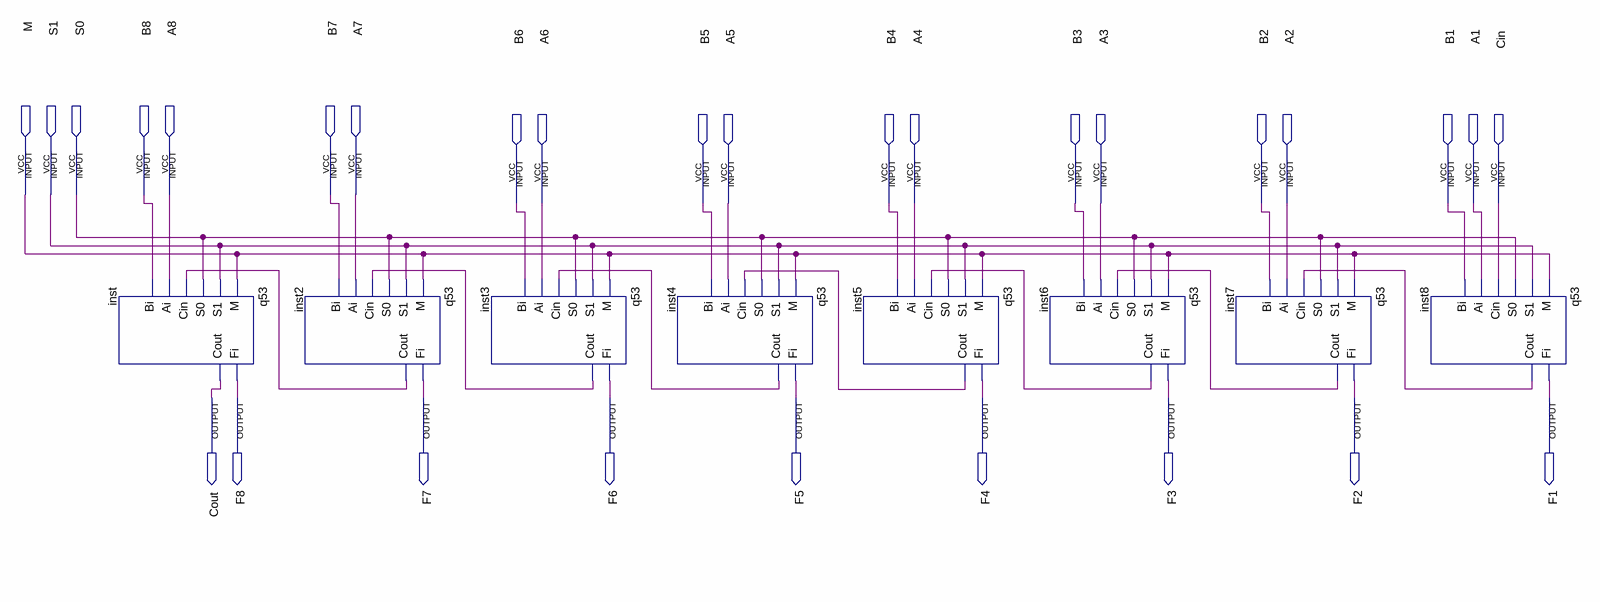
[diagram p0: schematic sheet]
// Quartus schematic q53final.bdf as structural Verilog: 8 symbols, 29 pins
module q53final (
  input  M,
  input  S1,
  input  S0,
  input  B8,
  input  A8,
  input  B7,
  input  A7,
  input  B6,
  input  A6,
  input  B5,
  input  A5,
  input  B4,
  input  A4,
  input  B3,
  input  A3,
  input  B2,
  input  A2,
  input  B1,
  input  A1,
  input  Cin,
  output Cout,
  output F8,
  output F7,
  output F6,
  output F5,
  output F4,
  output F3,
  output F2,
  output F1
);

  wire inst2_cout, inst3_cout, inst4_cout, inst5_cout, inst6_cout, inst7_cout, inst8_cout;

  q53 inst (.M(M), .S1(S1), .S0(S0), .Cin(inst2_cout), .Ai(A8), .Bi(B8), .Fi(F8), .Cout(Cout));
  q53 inst2 (.M(M), .S1(S1), .S0(S0), .Cin(inst3_cout), .Ai(A7), .Bi(B7), .Fi(F7), .Cout(inst2_cout));
  q53 inst3 (.M(M), .S1(S1), .S0(S0), .Cin(inst4_cout), .Ai(A6), .Bi(B6), .Fi(F6), .Cout(inst3_cout));
  q53 inst4 (.M(M), .S1(S1), .S0(S0), .Cin(inst5_cout), .Ai(A5), .Bi(B5), .Fi(F5), .Cout(inst4_cout));
  q53 inst5 (.M(M), .S1(S1), .S0(S0), .Cin(inst6_cout), .Ai(A4), .Bi(B4), .Fi(F4), .Cout(inst5_cout));
  q53 inst6 (.M(M), .S1(S1), .S0(S0), .Cin(inst7_cout), .Ai(A3), .Bi(B3), .Fi(F3), .Cout(inst6_cout));
  q53 inst7 (.M(M), .S1(S1), .S0(S0), .Cin(inst8_cout), .Ai(A2), .Bi(B2), .Fi(F2), .Cout(inst7_cout));
  q53 inst8 (.M(M), .S1(S1), .S0(S0), .Cin(Cin), .Ai(A1), .Bi(B1), .Fi(F1), .Cout(inst8_cout));
endmodule
